# EAGLE design RatDistortion (EAGLE 9.6.2)
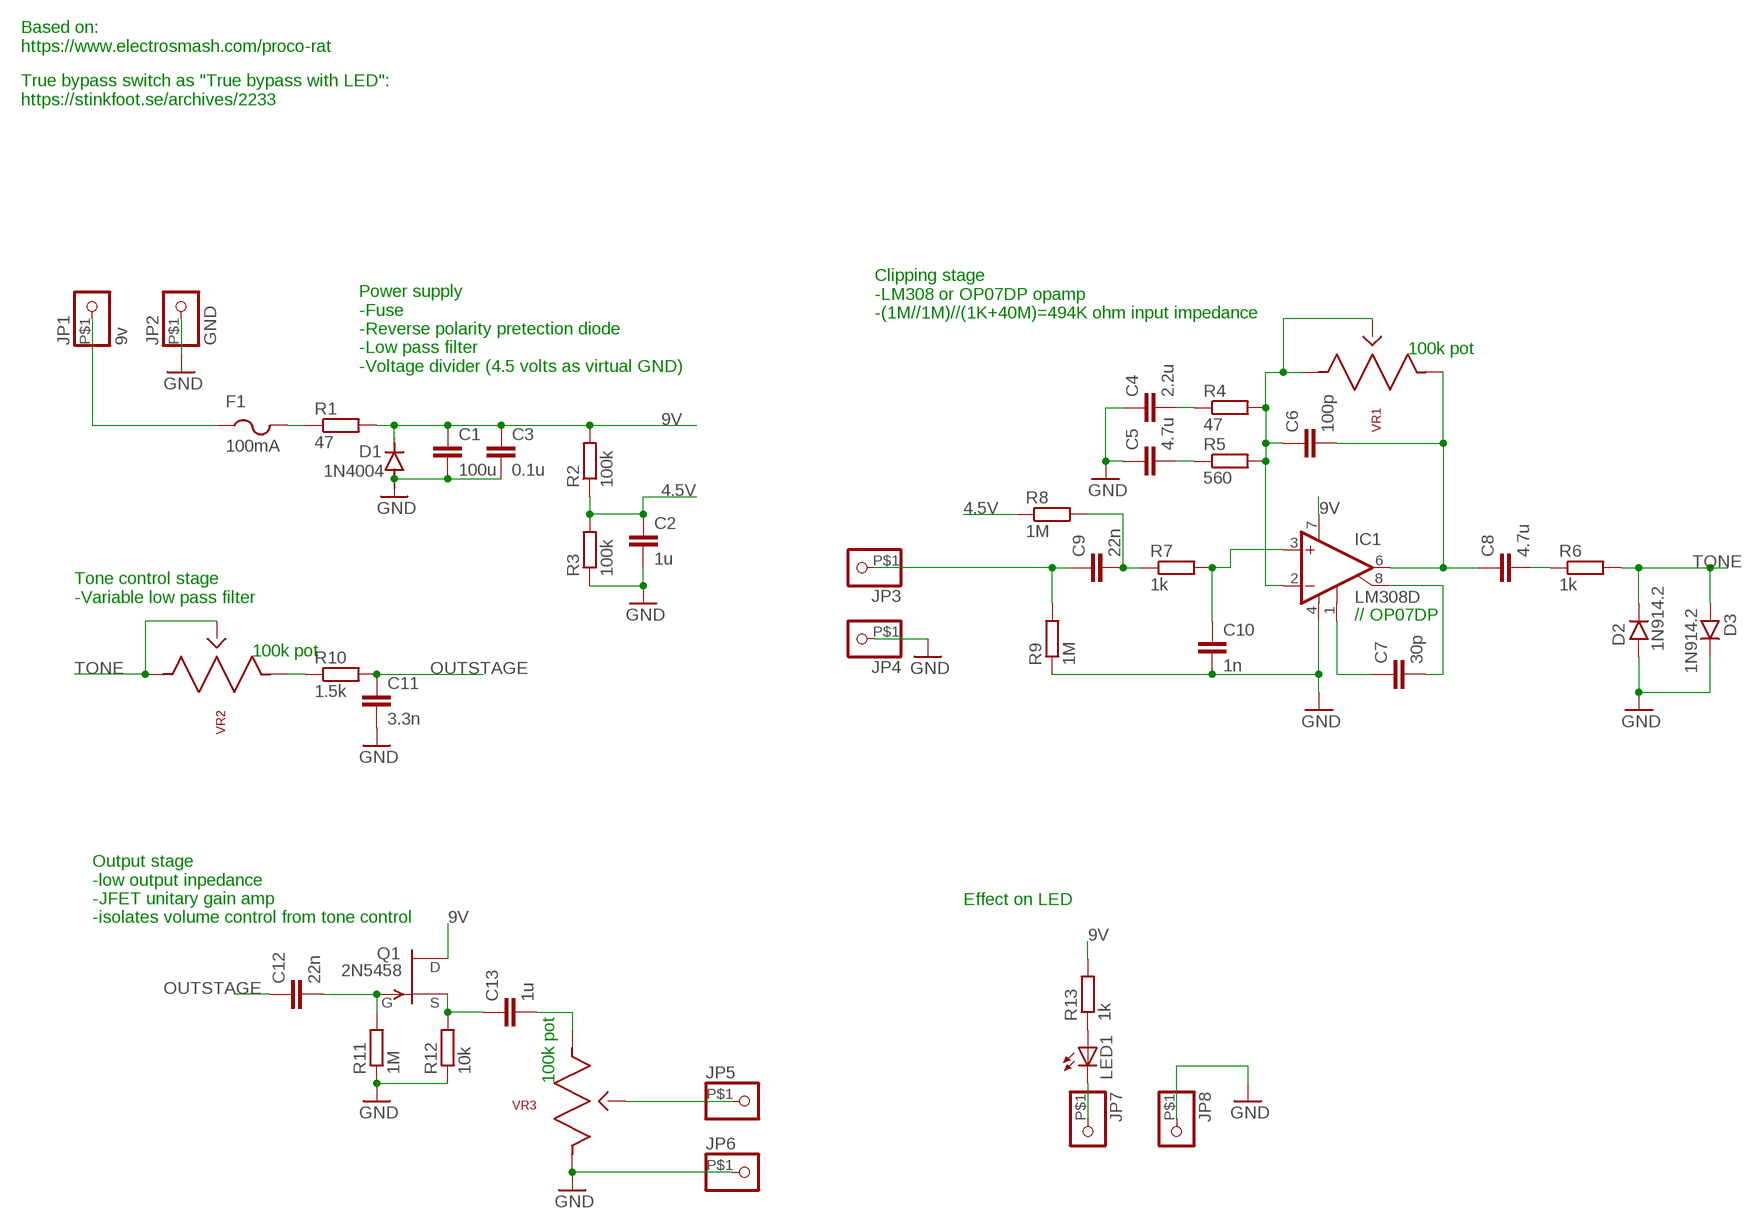
[diagram p0: schematic, sheet 1]

## Parts
C1  100u  C-EUC1206  [C1206]
C2  1u  C-EUC1206  [C1206]
C3  0.1u  C-EUC0603  [C0603]
C4  2.2u  C-EUC1206  [C1206]
C5  4.7u  C-EUC1206  [C1206]
C6  100p  C-EUC0603  [C0603]
C7  30p  C-EUC0603  [C0603]
C8  4.7u  C-EUC1206  [C1206]
C9  22n  C-EUC0603  [C0603]
C10  1n  C-EUC0603  [C0603]
C11  3.3n  C-EUC0603  [C0603]
C12  22n  C-EUC0603  [C0603]
C13  1u  C-EUC1206  [C1206]
D1  1N4004  [DO41-10]
D2  1N914.2  [DO35-2]
D3  1N914.2  [DO35-2]
F1  100mA  PTCFUSE-1812  [1812]
IC1  LM308D  [SO08]
JP1  9v  PINHD-1X1-BIGPOGO  [1X1-BIGPOGO]
JP2  GND  PINHD-1X1-BIGPOGO  [1X1-BIGPOGO]
JP3  PINHD-1X1-BIGPOGO  [1X1-BIGPOGO]
JP4  PINHD-1X1-BIGPOGO  [1X1-BIGPOGO]
JP5  PINHD-1X1-BIGPOGO  [1X1-BIGPOGO]
JP6  PINHD-1X1-BIGPOGO  [1X1-BIGPOGO]
JP7  PINHD-1X1-BIGPOGO  [1X1-BIGPOGO]
JP8  PINHD-1X1-BIGPOGO  [1X1-BIGPOGO]
LED1  LED3MM  [LED3MM]
Q1  2N5458  2N5458TO92  [TO92]
R1  47  R-EU_R0603  [R0603]
R2  100k  R-EU_R0603  [R0603]
R3  100k  R-EU_R0603  [R0603]
R4  47  R-EU_R0603  [R0603]
R5  560  R-EU_R0603  [R0603]
R6  1k  R-EU_R0603  [R0603]
R7  1k  R-EU_R0603  [R0603]
R8  1M  R-EU_R0603  [R0603]
R9  1M  R-EU_R0603  [R0603]
R10  1.5k  R-EU_R0603  [R0603]
R11  1M  R-EU_R0603  [R0603]
R12  10k  R-EU_R0603  [R0603]
R13  1k  R-EU_R0603  [R0603]
VR1  PTV09A-4225F-B104  [PTV09]
VR2  PTV09A-4225F-B104  [PTV09]
VR3  PTV09A-4225F-B104  [PTV09]

## Nets
4.5V: C2.1 R2.1 R3.2 R8.1
9V: C1.1 C3.1 D1.C IC1.7(V+) Q1.3(D) R1.2 R2.2 R13.2
GND: C1.2 C2.2 C3.2 C4.1 C5.1 C10.2 C11.2 D1.A D2.A D3.C IC1.4(V-) JP2.P$1 JP4.P$1 JP6.P$1 JP8.P$1 R3.1 R9.1 R11.1 R12.1 VR3.1
N$1: F1.2 R1.1
N$2: F1.1 JP1.P$1
N$3: C4.2 R4.1
N$4: C5.2 R5.1
N$5: C6.1 IC1.2(-IN) R4.2 R5.2 VR1.2 VR1.3
N$6: C6.2 C8.1 IC1.6(OUT) VR1.1
N$7: C8.2 R6.1
N$8: C12.2 Q1.1(G) R11.2
N$9: C7.1 IC1.1(CMP1)
N$10: C7.2 IC1.8(CMP2)
N$11: C13.1 Q1.2(S) R12.2
N$12: C10.1 IC1.3(+IN) R7.2
N$13: C9.2 R7.1 R8.2
N$14: C9.1 JP3.P$1 R9.2
N$16: R10.1 VR2.1
N$18: C13.2 VR3.3
N$19: LED1.A R13.1
N$20: JP5.P$1 VR3.2
N$21: JP7.P$1 LED1.K(C)
OUTSTAGE: C11.1 C12.1 R10.2
TONE: D2.C D3.A R6.2 VR2.2 VR2.3

## Notes on the sheet
- Based on:
  https://www.electrosmash.com/proco-rat
- True bypass switch as "True bypass with LED":
  https://stinkfoot.se/archives/2233
- Clipping stage
  -LM308 or OP07DP opamp
  -(1M//1M)//(1K+40M)=494K ohm input impedance
- 100k pot
- Power supply
  -Fuse
  -Reverse polarity pretection diode
  -Low pass filter
  -Voltage divider (4.5 volts as virtual GND)
- Tone control stage
  -Variable low pass filter
- // OP07DP
- 100k pot
- Effect on LED
- Output stage
  -low output inpedance
  -JFET unitary gain amp
  -isolates volume control from tone control
- 100k pot

## Library data of the parts
C1-C13 = rcl:C-EU: CAPACITOR, European symbol; SPICEPREFIX: C
D1 = diode:1N4004: DIODE general purpose rectifier, 1 A
D2 D3 = 1N914:1N914: Fast Switching Diode DO-35 glass case a.k.a. 1N4148 Check prices <https://pricing.snapeda.com/parts/1N914/ON%20Semiconductor/view-part?ref=eda>; AVAILABILITY: In Stock; DESCRIPTION: Diode Standard 75V 200mA Surface Mount SOD-523F; MF: ON Semiconductor; MP: 1N914; PACKAGE: AXIAL LEAD-2 ON Semiconductor; PRICE: None; PURCHASE-URL: https://pricing.snapeda.com/search/part/1N914/?ref=eda
F1 = adafruit:PTCFUSE: PTC fuses, resettable thermistors
IC1 = linear:LM308: OP AMP
JP1-JP8 = adafruit:PINHD-1X1: Pin header 1x1 for 0.1" spacing With round pins
LED1 = adafruit:LED: LED OSRAM: - CHIPLED LG R971, LG N971, LY N971, LG Q971, LY Q971, LO R971, LY R971 LH N974, LH R974 LS Q976, LO Q976, LY Q976 LO Q996 - Hyper CHIPLED LW Q18S LB Q993, LB Q99A, LB R99A - SideLED LS A670, LO A670, LY A670, LG A670, LP A670 LB A673, LV A673, LT A673, LW A673 LH A674 LY A675 LS A676, LA A676, LO A676, LY A676, LW A676 LS A679, LY A679, LG A679 - Hyper Micro SIDELED® LS Y876, LA Y876, LO Y876, LY Y876 LT Y87S - SmartLED LW L88C, LW L88S LB L89C, LB L89S, LG L890 LS L89K, LO L89K, LY L89K LS L896, LA L896, LO L896, LY L896 - TOPLED LS T670, LO T670, LY T670, LG T670, LP T670 LSG T670, LSP T670, LSY T670, LOP T670, LYG T670 LG T671, LOG T671, LSG T671 LB T673, LV T673, LT T673, LW T673 LH T674 LS T676, LA T676, LO T676, LY T676, LB T676, LH T676, LSB T676, LW T676 LB T67C, LV T67C, LT T67C, LS T67K, LO T67K, LY T67K, LW E67C LS E67B, LA E67B, LO E67B, LY E67B, LB E67C, LV E67C, LT E67C LW T67C LS T679, LY T679, LG T679 LS T770, LO T770, LY T770, LG T770, LP T770 LB T773, LV T773, LT T773, LW T773 LH T774 LS E675, LA E675, LY E675, LS T675 LS T776, LA T776, LO T776, LY T776, LB T776 LHGB T686 LT T68C, LB T68C - Hyper Mini TOPLED® LB M676 - Mini TOPLED Santana® LG M470 LS M47K, LO M47K, LY M47K Source: http://www.osram.convergy.de/
Q1 = 2N5458_2:2N5458: 2N5458 JFET transistor
R1-R13 = rcl:R-EU_: RESISTOR, European symbol; SPICEPREFIX: R
VR1-VR3 = PTV09A-4225F-B104:PTV09A-4225F-B104: 100k Ohm 1 Gang Linear Through Hole, Snap In Potentiometer Detent 1 Turn Carbon 0.05W, 1/20W PC Pins, Board Locks (NOT RA) Check prices <https://pricing.snapeda.com/parts/PTV09A-4225F-B104/Bourns/view-part?ref=eda>; AVAILABILITY: In Stock; DESCRIPTION: 100k Ohm 1 Gang Linear Through Hole, Snap In Potentiometer Detent 1.0 Kierros Carbon 0.05W, 1/20W PC Pins, Board Locks; MF: Bourns; MP: PTV09A-4225F-B104; PACKAGE: None; PRICE: None; PURCHASE-URL: https://pricing.snapeda.com/search/part/PTV09A-4225F-B104/?ref=eda

## Board
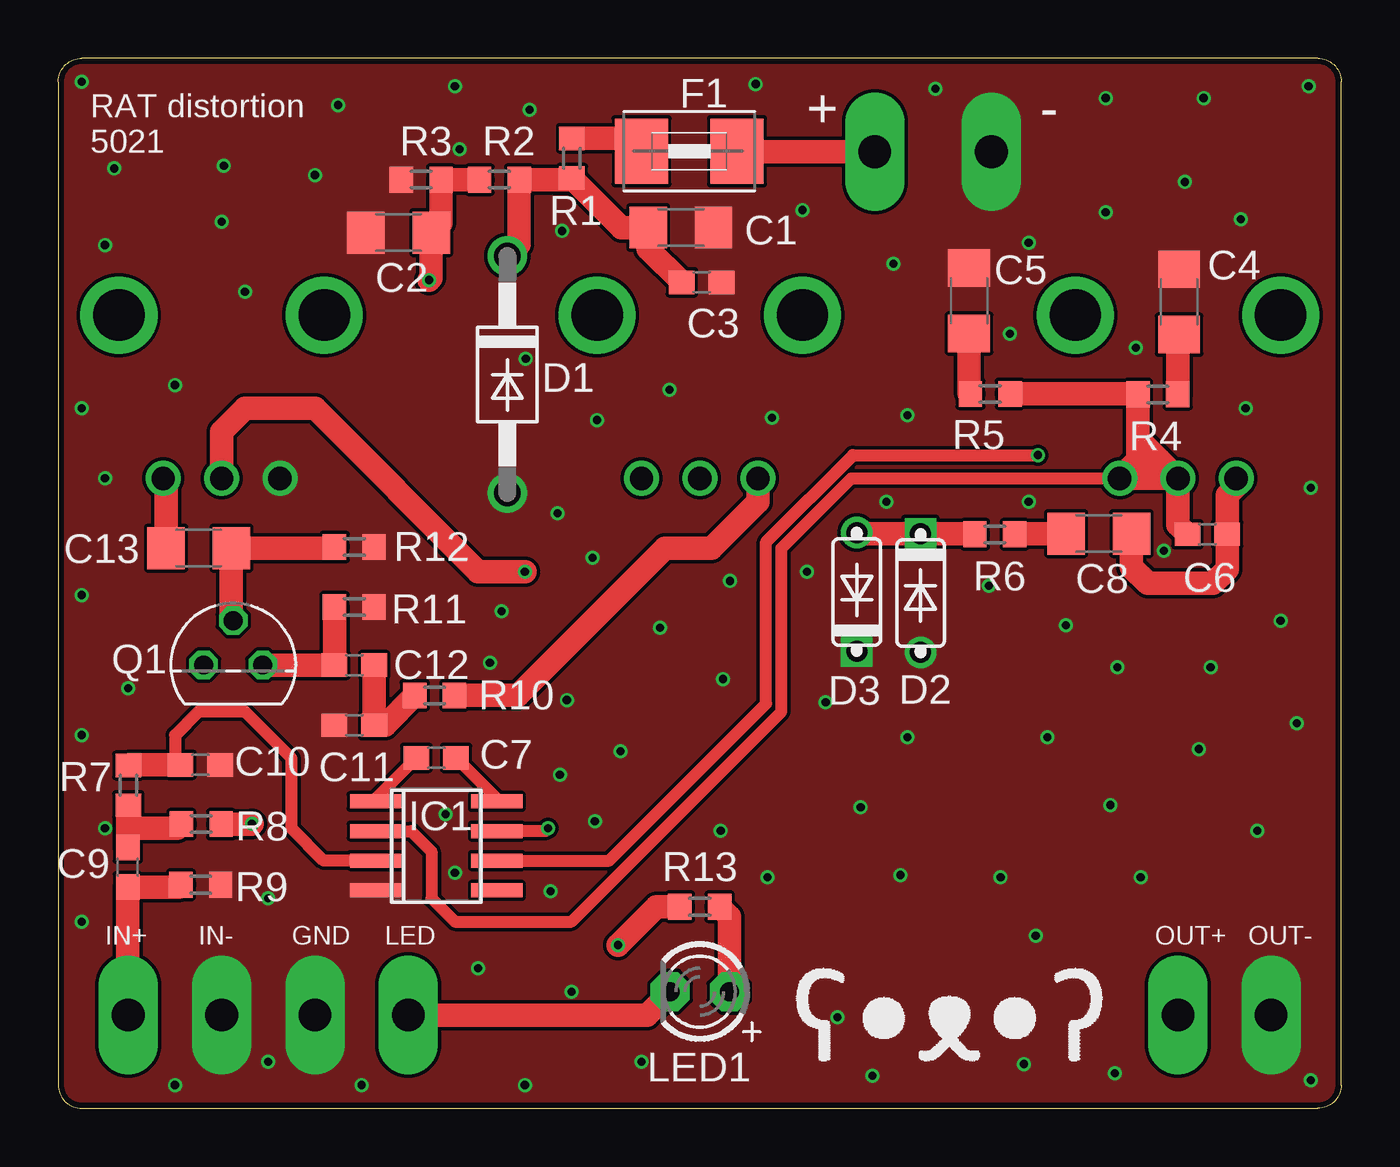
[diagram p1: board, top side]
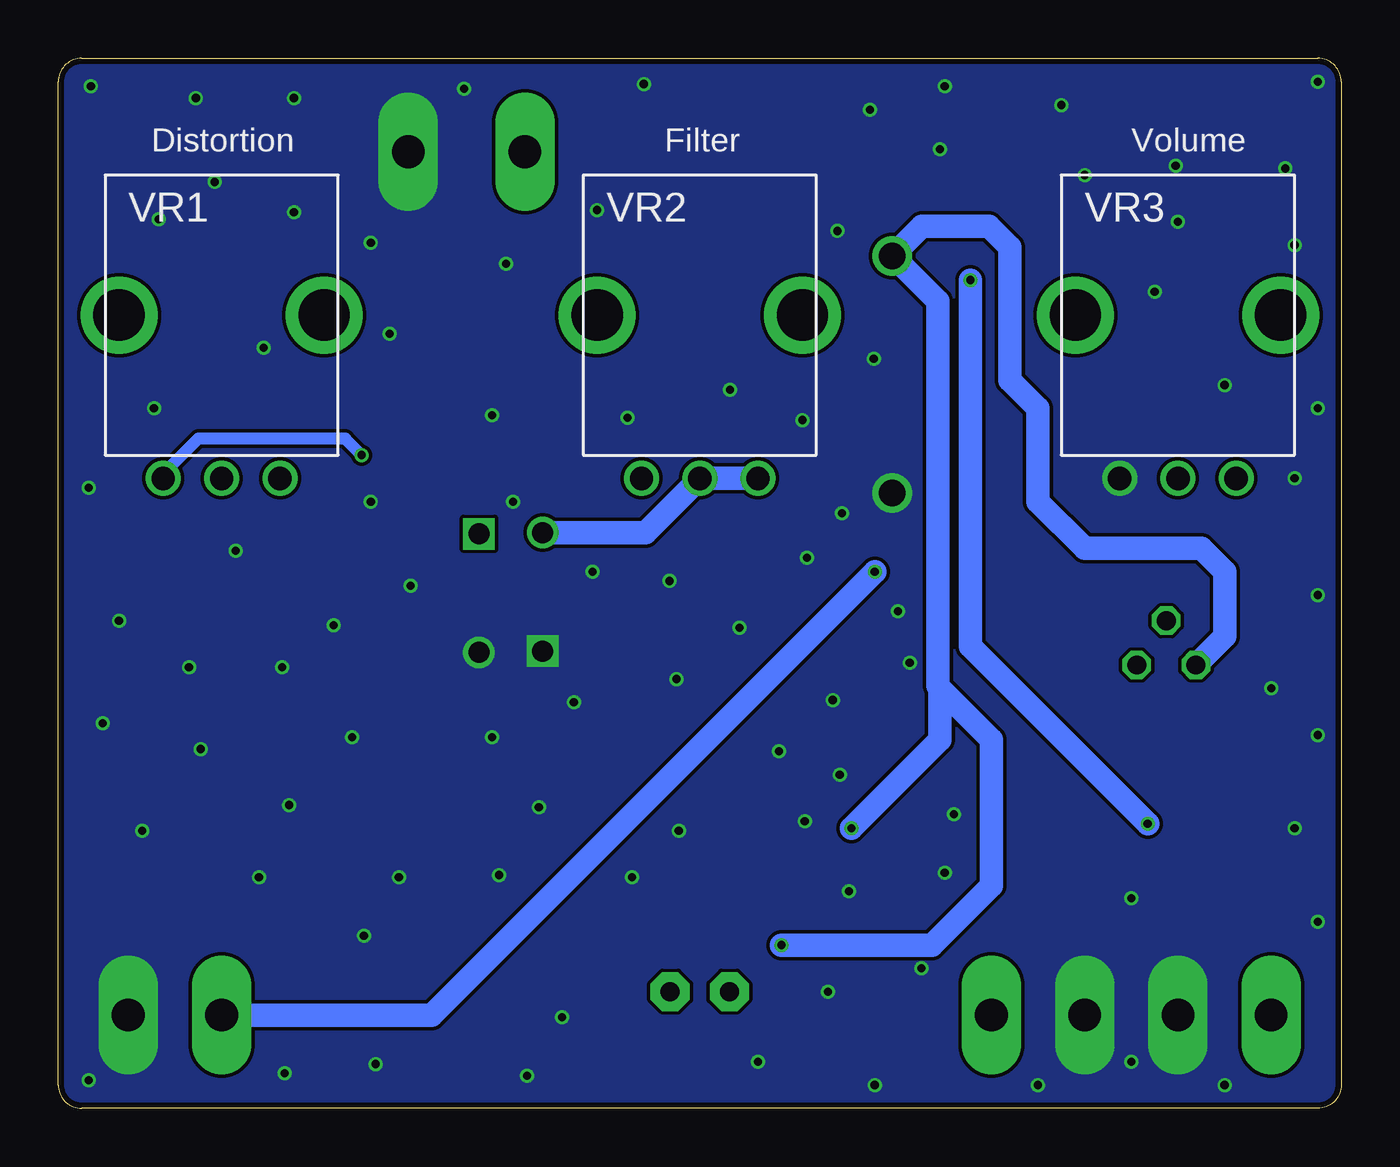
[diagram p2: board, bottom side, seen from below]

Size 55 x 45 mm. Coordinates in mm from the lower left corner, seen from the top.
Outline: 1,0 54,0 arc90 55,1 55,44 arc90 54,45 1,45 arc90 0,44 0,1 arc90 1,0
Copper layers (1*16): Top 0.018mm / dielectric 1.55mm / Bottom 0.018mm
Design rules "eC_2Layer_PClass6_BaseCopperO18_eCDefault": minimum track width 0.15mm, minimum drill 0.35mm, track to track 0.15mm, track to pad 0.15mm, pad to pad 0.15mm, via to via 0.15mm, smd to smd 0mil, copper to edge 0.25mm, drill to drill 0.35mm, minimum pad ring 0.175mm, minimum via ring 0.125mm, stop-mask expansion 0mil, vias tented up to drill 0.45mm, thermal gap 0.2mm

### Footprints (pad centres in the part's own frame; a part is rotated, then mirrored left to right if it is on the bottom)
C1206 = smd 1.6 x 1.8: 1 -1.4,0; 2 1.4,0
C0603 = smd 1.1 x 1: 1 -0.85,0; 2 0.85,0
DO41-10 = drill 1.118: A 5.08,0; C -5.08,0
DO35-2 = drill 0.9: A 2.54,0 | drill 0.9 square: C -2.54,0
1812 = smd 2.286 x 2.794: 1 -2.046,0; 2 2.046,0
SO08 = smd 0.6 x 2.2: 1 -1.905,-2.6; 2 -0.635,-2.6; 3 0.635,-2.6; 4 1.905,-2.6; 5 1.905,2.6; 6 0.635,2.6; 7 -0.635,2.6; 8 -1.905,2.6
1X1-BIGPOGO = drill 1.4 pad 2.54 long: P$1 0,0
LED3MM = drill 0.813 pad 1.676 octagon: A -1.27,0; K 1.27,0
TO92 = drill 0.813 octagon: 1 1.27,0; 2 0,1.905; 3 -1.27,0
R0603 = smd 1 x 1.1: 1 -0.85,0; 2 0.85,0
PTV09 = drill 1: 1 -2.5,0; 2 0,0; 3 2.5,0 | drill 2.2: NC1 -4.4,7; NC2 4.4,7

### Placement (x,y rotation side)
C1  26.69,37.75 0 top
C2  14.59,37.53 180 top
C3  27.58,35.4 0 top
C4  48.05,34.56 270 top
C5  39.05,34.61 270 top
C6  49.26,24.6 0 top
C7  16.2,15.02 0 top
C8  44.61,24.63 180 top
C9  2.98,10.33 90 top
C10  6.09,14.72 0 top
C11  12.69,16.42 180 top
C12  12.69,19 180 top
C13  6.02,24.01 180 top
D1  19.25,31.45 270 top
D2  36.97,22.08 270 top
D3  34.23,22.13 90 top
F1  27.05,41.02 180 top
IC1  16.2,11.25 270 top
JP1  35,41 90 top
JP2  52,4 90 top
JP3  3,4 90 top
JP4  7,4 90 top
JP5  48,4 90 top
JP6  40,41 90 top
JP7  15,4 270 bottom
JP8  11,4 90 top
LED1  27.5,5 180 top
Q1  7.5,19 0 top
R1  22.02,40.72 270 top
R2  18.91,39.8 0 top
R3  15.56,39.8 0 top
R4  47.14,30.6 180 top
R5  39.95,30.62 0 top
R6  40.15,24.6 180 top
R7  3,13.84 90 top
R8  6.13,12.18 180 top
R9  6.11,9.58 180 top
R10  16.13,17.7 180 top
R11  12.69,21.48 180 top
R12  12.69,24.06 180 top
R13  27.5,8.64 180 top
VR1  48,27 0 bottom
VR2  27.5,27 0 bottom
VR3  7,27 0 bottom

### Tracks (layer width: path | path; a pad name or v marks a point on that pad's centre or on a via)
4.5V  (via drill 0.35)
  Top 1.016: R2.1 R3.2 16.41,37.95 C2.1 15.99,35.59 v15.9,35.5 | R8.1 8.28,12.18 v8.3,12.2
  Bottom 1.016: v8.3,12.2 15.9,19.8 v15.9,35.5
9V  (via drill 0.35)
  Top 0.508: v21,12 20.89,11.88 IC1.7
  Top 1.016: D1.C 19.76,37.04 R2.2 21.95,39.8 R1.2 24.14,37.75 C1.1 25.29,36.84 C3.1 | R13.2 25.64,8.64 v24,7
  Bottom 1.016: Q1.3 5,20.23 5,23 6,24 11,24 13,26 13,30 14.2,31.2 14.2,36.9 15.1,37.8 17.98,37.8 D1.C 17.3,34.58 17.3,18.1 17.2,18 | 17.2,18 15,15.8 15,9.54 17.55,7 v24,7 | 17.2,18 17.2,15.8 v21,12
GND  (via drill 0.35)
  other vias: 1,44 2.4,40.28 12,43 7,38 2,37 11,40 8,35 5,31 1,30 2,27 1,22 3,18 1,8 1,16 2,12 9,9 9,2 5,1 13,1 22,5 20,1 25,2 18,6 21.1,9.3 16.6,12.6 21.8,17.5 24.1,15.3 21.5,14.3 23,12.3 19,21.3 18.5,19.1 17,10.1 28.8,22.6 25.8,20.6 28.5,18.4 21.4,25.5 22.9,23.6 26.2,30.8 20.04,32.12 21.6,37.6 30.6,29.6 23.1,29.5 31.9,38.5 36.4,29.7 35.8,36.2 37.6,43.7 29.9,43.9 20.2,42.8 17,43.8 17.2,41.1 53.6,43.8 44.9,43.3 44.9,38.4 41.6,37.1 40.8,33.2 46.2,32.6 50.9,30 50.7,38.1 48.3,39.7 53.7,26.6 43.2,20.7 35.5,26 41.6,26 47.4,23.9 36.4,15.9 49.4,18.9 42.4,15.9 45.4,18.9 51.4,11.9 46.4,9.9 52.4,20.9 40.4,9.9 34.4,12.9 33.4,3.9 41.4,1.9 30.4,9.9 28.4,11.9 53.7,1.2 45.3,1.5 34.9,1.4 41.9,7.4 48.9,15.4 39.9,22.4 32.9,17.4 32.1,23 45.1,13 36.1,10 7.1,40.4 53.1,16.5 49.1,43.3
  pour Top (no thermals): 0,45 0,0 55,0 55,45
  pour Bottom (no thermals): 0,45 0,0 55,0 55,45
N$1
  Top 1.016: F1.2 24.45,41.57 R1.1
N$2
  Top 1.016: F1.1 29.12,41 JP1.P$1
N$3
  Top 1.016: R4.1 47.99,33.1 C4.2
N$4
  Top 1.016: R5.1 39.05,30.67 C5.2
N$5
  Top 0.508: IC1.2 15.12,11.88 16,11 16,9 17,8 22,8 31,17 31,24 34,27 VR1.3
  Top 1.016: 46.29,28.71 R4.2 46.27,30.62 R5.2 | 46.29,28.71 46.29,27.79 | 46.29,27.79 VR1.3 VR1.2 | VR1.2 47.21,27.79 | 47.21,27.79 46.29,27.79 | 47.21,27.79 46.29,28.71 | C6.1 48,25.01 VR1.2
N$6  (via drill 0.35)
  Top 0.508: IC1.6 23.61,10.62 30.34,17.34 30.34,24.27 34.07,28 v42,28
  Top 1.016: VR1.1 50.67,26.83 50.11,26.27 C6.2 50.11,23.11 49.5,22.5 46.7,22.5 46.01,23.19 C8.1
  Bottom 0.508: VR1.1 50.5,27.2 49,28.7 42.7,28.7 v42,28
N$7
  Top 1.016: R6.1 41.03,24.63 C8.2
N$8
  Top 1.016: R11.2 C12.2 Q1.1
N$9
  Top 0.508: C7.1 13.6,13.27 IC1.1
N$10
  Top 0.508: C7.2 18.8,13.27 IC1.8
N$11
  Top 1.016: R12.2 11.79,24.01 C13.1 7.42,20.98 Q1.2
N$12
  Top 0.508: IC1.3 11.38,10.62 10,12 10,15 8,17 6,17 5,16 5,14.96 C10.1
  Top 1.016: R7.2 3.03,14.72 C10.1
N$13
  Top 1.016: C9.2 2.98,12 | 2.98,12 2.98,12.97 R7.1 | R8.2 5.1,12 2.98,12
N$14
  Top 1.016: JP3.P$1 2.98,4.02 C9.1 5.16,9.48 R9.2
N$16
  Top 1.016: R10.1 19.7,17.7 26,24 28,24 30,26 VR2.1
N$18
  Top 1.016: C13.2 4.62,26.88 VR3.3
N$19
  Top 1.016: LED1.A 28.77,8.22 R13.1
N$20  (via drill 0.35)
  Top 1.016: v20,23 18,23 11,30 8,30 7,29 VR3.2
  Bottom 1.016: JP5.P$1 39,4 v20,23
N$21
  Top 1.016: LED1.K 25.23,4 JP7.P$1
OUTSTAGE
  Top 1.016: C12.1 C11.1 14,16.42 R10.2
TONE
  Top 1.016: D3.A 34.28,24.62 D2.C 39.28,24.62 R6.2
  Bottom 1.016: VR2.3 VR2.2 29.83,24.67 D3.A

### Text on the board
tPlace: + | - | RAT distortion / 5021 | IN+ | IN- | GND | LED | OUT+ | OUT-
bPlace: Volume | Filter | Distortion
Measures: inside | outside